# EAGLE design single_LED (EAGLE 7.3.0)
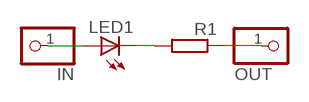
[diagram p0: schematic, sheet 1]

## Parts
IN  PINHD-1X1CB  [1X01-CLEANBIG]
LED1  LED-0805  [LED-805]
OUT  PINHD-1X1CB  [1X01-CLEANBIG]
R1  RESISTORR805-0805  [R805]

## Nets
IN: IN.1 LED1.A
N$2: LED1.C R1.2
OUT: OUT.1 R1.1

## Library data of the parts
IN OUT = adafruit:PINHD-1X1: Pin header 1x1 for 0.1" spacing With round pins
LED1 = dp_devices:LED: Light Emitting Diode
R1 = dp_devices:RESISTOR

## Board
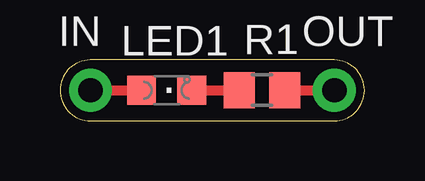
[diagram p1: board, top side]

Size 12.69 x 2.53 mm. Coordinates in mm from the lower left corner, seen from the top.
Outline: 0,1.27 arc90 1.27,0 11.43,0 arc90 12.69,1.26 12.69,1.27 arc90 11.43,2.53 1.26,2.53 arc90 0,1.27
Copper layers (1*16): Top 0.035mm / dielectric 1.5mm / Bottom 0.035mm
Design rules "dirt_cheap_dirty_boards.v1": minimum track width 5mil, minimum drill 12mil, track to track 5mil, track to pad 5mil, pad to pad 5mil, via to via 5mil, smd to smd 0mil, copper to edge 10mil, drill to drill 10mil, minimum pad ring 10mil, minimum via ring 6mil, stop-mask expansion 2mil, vias tented up to drill 25mil, thermal gap 10mil

### Footprints (pad centres in the part's own frame; a part is rotated, then mirrored left to right if it is on the bottom)
1X01-CLEANBIG = drill 1.016 pad 1.778: 1 0,0
LED-805 = smd 1.2 x 1.2: A 0,-1.05; C 0,1.05
R805 = smd 1.3 x 1.5: 1 -0.95,0; 2 0.95,0

### Placement (x,y rotation side)
IN  1.27,1.27 0 top
LED1  4.45,1.27 270 top
OUT  11.43,1.27 0 top
R1  8.41,1.27 180 top

### Tracks (layer width: path | path; a pad name or v marks a point on that pad's centre or on a via)
IN
  Top 0.406: IN.1 LED1.A
N$2
  Top 0.406: LED1.C R1.2
OUT
  Top 0.406: R1.1 OUT.1